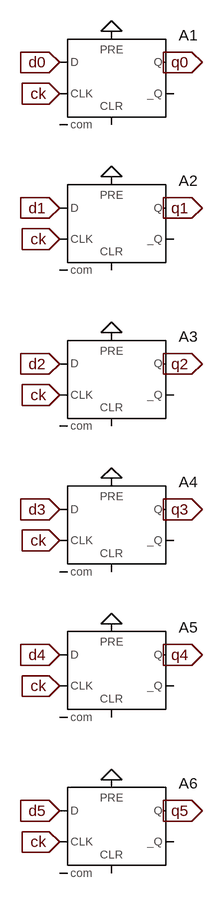
[diagram p0: schematic dff_ideal_5.asc]
dff_ideal_5.asc, the LTspice schematic file:
Version 4
SHEET 1 880 808
FLAG -32 -464 d0
IOPIN -32 -464 In
FLAG -32 -416 ck
IOPIN -32 -416 In
FLAG 128 -464 q0
IOPIN 128 -464 Out
FLAG -32 -240 d1
IOPIN -32 -240 In
FLAG -32 -192 ck
IOPIN -32 -192 In
FLAG 128 -240 q1
IOPIN 128 -240 Out
FLAG -32 0 d2
IOPIN -32 0 In
FLAG -32 48 ck
IOPIN -32 48 In
FLAG 128 0 q2
IOPIN 128 0 Out
FLAG -32 224 d3
IOPIN -32 224 In
FLAG -32 272 ck
IOPIN -32 272 In
FLAG 128 224 q3
IOPIN 128 224 Out
FLAG -32 448 d4
IOPIN -32 448 In
FLAG -32 496 ck
IOPIN -32 496 In
FLAG 128 448 q4
IOPIN 128 448 Out
FLAG 48 -512 0
FLAG 48 -288 0
FLAG 48 -48 0
FLAG 48 176 0
FLAG 48 400 0
FLAG -32 688 d5
IOPIN -32 688 In
FLAG -32 736 ck
IOPIN -32 736 In
FLAG 128 688 q5
IOPIN 128 688 Out
FLAG 48 640 0
SYMBOL Digital/dflop 48 -512 R0
WINDOW 3 8 6 Invisible 2
SYMATTR Value Vhigh = 3.3 Vlow = 0 Trise = 'tt' Tfall = 'tt'
SYMATTR InstName A1
SYMBOL Digital/dflop 48 -288 R0
WINDOW 3 8 6 Invisible 2
SYMATTR Value Vhigh = 3.3 Vlow = 0 Trise = 'tt' Tfall = 'tt'
SYMATTR InstName A2
SYMBOL Digital/dflop 48 -48 R0
WINDOW 3 8 6 Invisible 2
SYMATTR Value Vhigh = 3.3 Vlow = 0 Trise = 'tt' Tfall = 'tt'
SYMATTR InstName A3
SYMBOL Digital/dflop 48 176 R0
WINDOW 3 8 6 Invisible 2
SYMATTR Value Vhigh = 3.3 Vlow = 0 Trise = 'tt' Tfall = 'tt'
SYMATTR InstName A4
SYMBOL Digital/dflop 48 400 R0
WINDOW 3 8 6 Invisible 2
SYMATTR Value Vhigh = 3.3 Vlow = 0 Trise = 'tt' Tfall = 'tt'
SYMATTR InstName A5
SYMBOL Digital/dflop 48 640 R0
WINDOW 3 8 6 Invisible 2
SYMATTR Value Vhigh = 3.3 Vlow = 0 Trise = 'tt' Tfall = 'tt'
SYMATTR InstName A6

The netlist it stands for:
* dff_ideal_5.asc
A1 d0 0 ck 0 0 0 q0 0 DFLOP Vhigh = 3.3 Vlow = 0 Trise = 'tt' Tfall = 'tt'
A2 d1 0 ck 0 0 0 q1 0 DFLOP Vhigh = 3.3 Vlow = 0 Trise = 'tt' Tfall = 'tt'
A3 d2 0 ck 0 0 0 q2 0 DFLOP Vhigh = 3.3 Vlow = 0 Trise = 'tt' Tfall = 'tt'
A4 d3 0 ck 0 0 0 q3 0 DFLOP Vhigh = 3.3 Vlow = 0 Trise = 'tt' Tfall = 'tt'
A5 d4 0 ck 0 0 0 q4 0 DFLOP Vhigh = 3.3 Vlow = 0 Trise = 'tt' Tfall = 'tt'
A6 d5 0 ck 0 0 0 q5 0 DFLOP Vhigh = 3.3 Vlow = 0 Trise = 'tt' Tfall = 'tt'
.backanno
.end